# EAGLE design Trabajo3 (EAGLE 9.6.2)
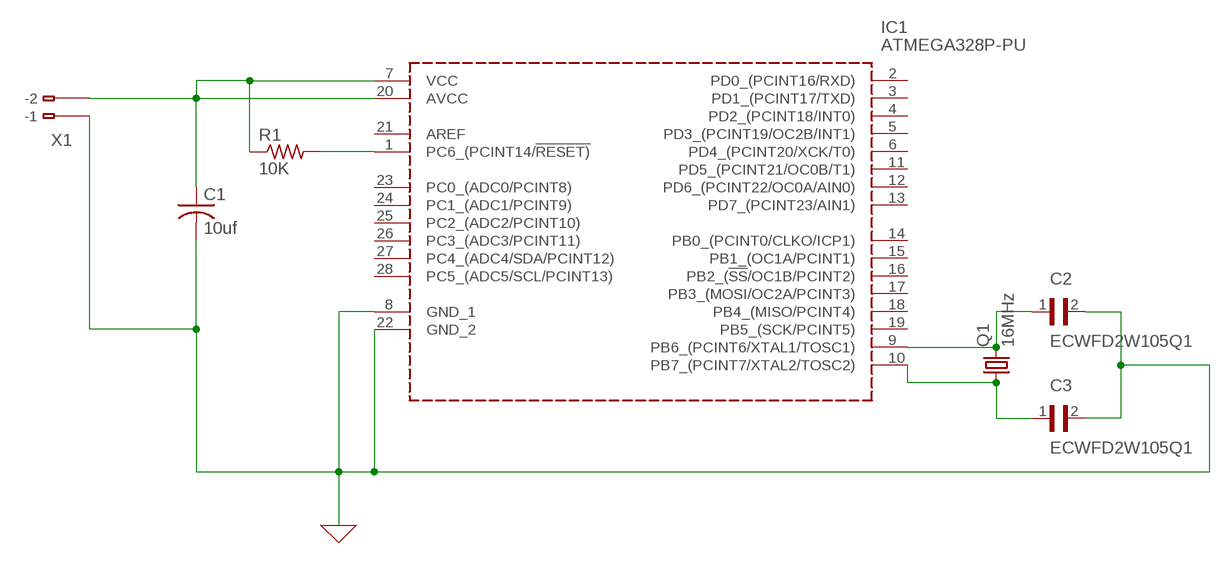
[diagram p0: schematic, sheet 1]

## Parts
C1  10uf  C-US025-024X044  [C025-024X044]
C2  ECWFD2W105Q1  [CAPRR1000W60L1260T920H1390]
C3  ECWFD2W105Q1  [CAPRR1000W60L1260T920H1390]
IC1  ATMEGA328P-PU  [DIP794W53P254L3467H457Q28N]
Q1  16MHz  CRYSTALHC33U-V  [HC33U-V]
R1  10K  R-US_0204/2V  [0204V]
X1  233-102  [233-102]

## Nets
0: C1.2 C2.2 C3.2 IC1.8(GND_1) IC1.22(GND_2) X1.B1(B-1) ; supply symbol labelled GND
N$1: C2.1 IC1.9(PB6_(PCINT6/XTAL1/TOSC1)) Q1.2
N$2: C3.1 IC1.10(PB7_(PCINT7/XTAL2/TOSC2)) Q1.1
N$5: IC1.1(PC6_(PCINT14/!RESET)) R1.2
N$6: C1.1 IC1.7(VCC) IC1.20(AVCC) R1.1 X1.B2(B-2)
Unconnected: IC1.2(PD0_(PCINT16/RXD)) IC1.3(PD1_(PCINT17/TXD)) IC1.4(PD2_(PCINT18/INT0)) IC1.5(PD3_(PCINT19/OC2B/INT1)) IC1.6(PD4_(PCINT20/XCK/T0)) IC1.11(PD5_(PCINT21/OC0B/T1)) IC1.12(PD6_(PCINT22/OC0A/AIN0)) IC1.13(PD7_(PCINT23/AIN1)) IC1.14(PB0_(PCINT0/CLKO/ICP1)) IC1.15(PB1_(OC1A/PCINT1)) IC1.16(PB2_(!SS!/OC1B/PCINT2)) IC1.17(PB3_(MOSI/OC2A/PCINT3)) IC1.18(PB4_(MISO/PCINT4)) IC1.19(PB5_(SCK/PCINT5)) IC1.21(AREF) IC1.23(PC0_(ADC0/PCINT8)) IC1.24(PC1_(ADC1/PCINT9)) IC1.25(PC2_(ADC2/PCINT10)) IC1.26(PC3_(ADC3/PCINT11)) IC1.27(PC4_(ADC4/SDA/PCINT12)) IC1.28(PC5_(ADC5/SCL/PCINT13)) X1.A1(-1) X1.A2(-2)

## Library data of the parts
C1 = rcl:C-US: CAPACITOR, American symbol; SPICEPREFIX: C
C2 = ECWFD2W105Q1:ECWFD2W105Q1: Check availability <https://pricing.snapeda.com/parts/ECWFD2W105Q1/Panasonic/view-part?ref=eda>; AVAILABILITY: In Stock; C2: 22Pf; CHECK_PRICES: https://www.snapeda.com/parts/ECWFD2W105Q1/Panasonic/view-part/?ref=eda; DESCRIPTION: Metallized Polypropylene Film Capacitor; MF: Panasonic; MP: ECWFD2W105Q1; PACKAGE: RADIAL-2 Panasonic; PRICE: None; PURCHASE-URL: https://www.snapeda.com/api/url_track_click_mouser/?unipart_id=5786160&manufacturer=Panasonic&part_name=ECWFD2W105Q1&search_term=capacitor; SNAPEDA_LINK: https://www.snapeda.com/parts/ECWFD2W105Q1/Panasonic/view-part/?ref=snap
C3 = ECWFD2W105Q1:ECWFD2W105Q1: Check availability <https://pricing.snapeda.com/parts/ECWFD2W105Q1/Panasonic/view-part?ref=eda>; AVAILABILITY: In Stock; C3: 22Pf; CHECK_PRICES: https://www.snapeda.com/parts/ECWFD2W105Q1/Panasonic/view-part/?ref=eda; DESCRIPTION: Metallized Polypropylene Film Capacitor; MF: Panasonic; MP: ECWFD2W105Q1; PACKAGE: RADIAL-2 Panasonic; PRICE: None; PURCHASE-URL: https://www.snapeda.com/api/url_track_click_mouser/?unipart_id=5786160&manufacturer=Panasonic&part_name=ECWFD2W105Q1&search_term=capacitor; SNAPEDA_LINK: https://www.snapeda.com/parts/ECWFD2W105Q1/Panasonic/view-part/?ref=snap
IC1 = ATMEGA328P-PU:ATMEGA328P-PU: Check availability <https://pricing.snapeda.com/parts/ATMEGA328PPU/Microchip%20Technology/view-part?ref=eda>; AVAILABILITY: In Stock; CHECK_PRICES: https://www.snapeda.com/parts/ATMEGA328PPU/Microchip+Technology/view-part/?ref=eda; DESCRIPTION: AVR AVR® ATmega Microcontroller IC 8-Bit 20MHz 32KB (16K x 16) FLASH 28-PDIP; MF: Microchip Technology; MP: ATMEGA328PPU; PACKAGE: None; PRICE: None; SNAPEDA_LINK: https://www.snapeda.com/parts/ATMEGA328PPU/Microchip+Technology/view-part/?ref=snap
Q1 = crystal:CRYSTAL: CRYSTAL; HOLA: 16MHZ; OC_FARNELL: unknown; OC_NEWARK: unknown
R1 = rcl:R-US_: RESISTOR, American symbol; SPICEPREFIX: R
X1 = con-wago:233-102: WAGO Cage Clamp; MPN: 233-102; OC_FARNELL: unknown; OC_NEWARK: 28K9044

## Board
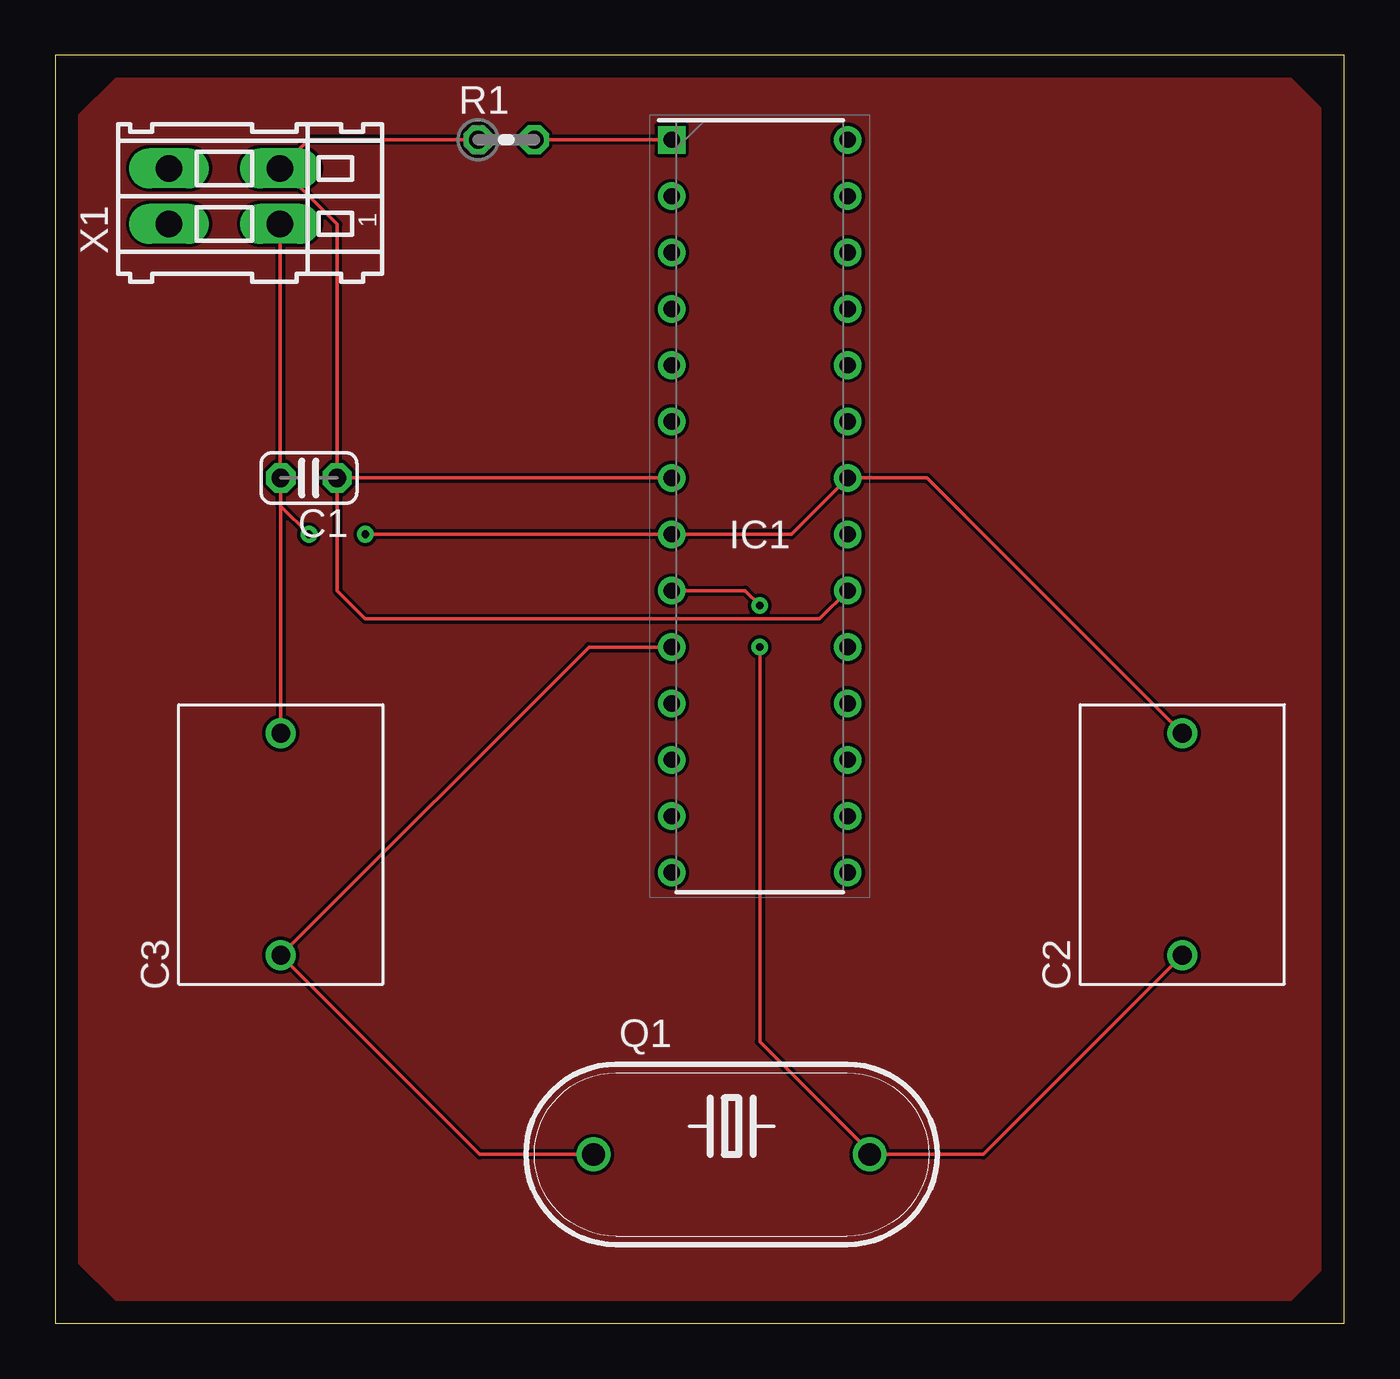
[diagram p1: board, top side]
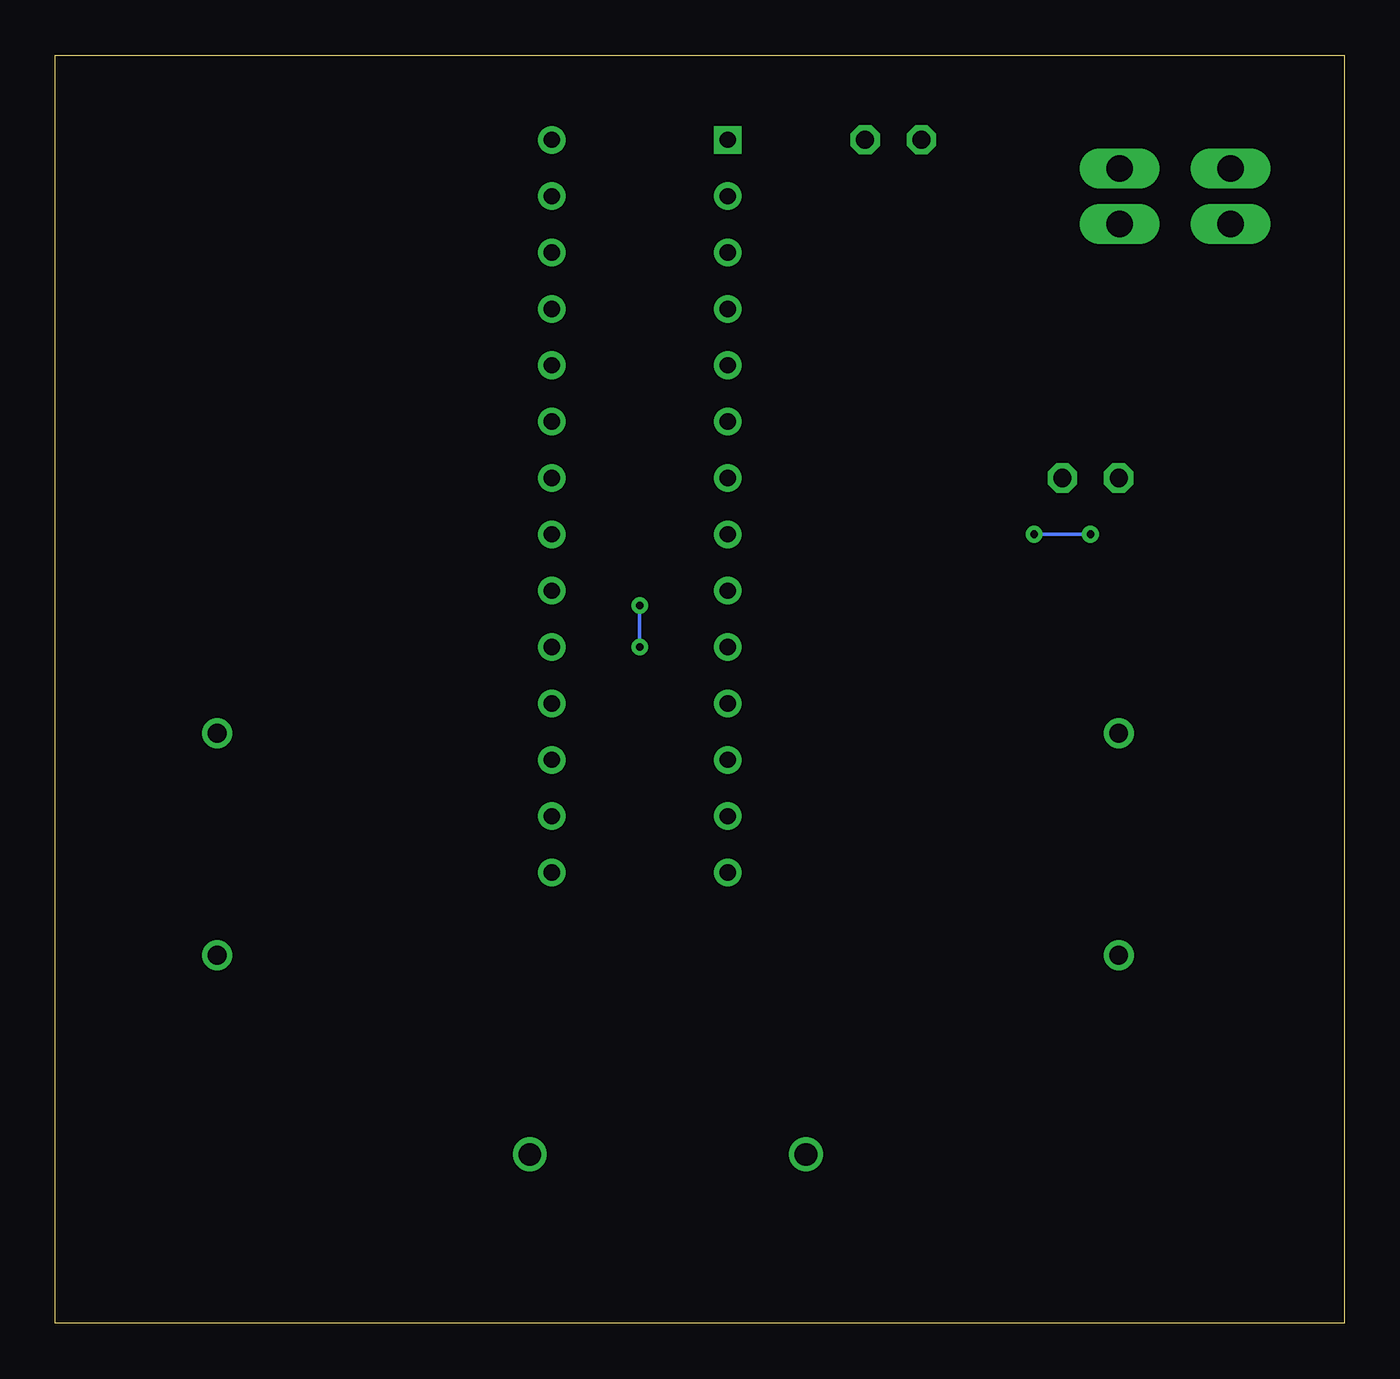
[diagram p2: board, bottom side, seen from below]

Size 58.09 x 57.14 mm. Coordinates in mm from the lower left corner, seen from the top.
Outline: 0,0 58.09,0 58.09,57.14 0,57.14 0,0
Copper layers (1*16): Top 0.035mm / dielectric 1.5mm / Bottom 0.035mm
Design rules "default": minimum track width 6mil, minimum drill 0.35mm, track to track 6mil, track to pad 6mil, pad to pad 6mil, via to via 6mil, smd to smd 6mil, copper to edge 40mil, drill to drill 6mil, minimum pad ring 10mil, minimum via ring 8mil, stop-mask expansion 4mil, vias tented up to drill 0mil, thermal gap 10mil

### Footprints (pad centres in the part's own frame; a part is rotated, then mirrored left to right if it is on the bottom)
C025-024X044 = drill 0.813 octagon: 1 -1.27,0; 2 1.27,0
CAPRR1000W60L1260T920H1390 = drill 0.85 pad 1.2: 1 -5,0; 2 5,0
DIP794W53P254L3467H457Q28N = drill 0.733 pad 1.133 square: 1 -3.969,16.51 | drill 0.733 pad 1.133: 2 -3.969,13.97; 3 -3.969,11.43; 4 -3.969,8.89; 5 -3.969,6.35; 6 -3.969,3.81; 7 -3.969,1.27; 8 -3.969,-1.27; 9 -3.969,-3.81; 10 -3.969,-6.35; 11 -3.969,-8.89; 12 -3.969,-11.43; 13 -3.969,-13.97; 14 -3.969,-16.51; 15 3.969,-16.51; 16 3.969,-13.97; 17 3.969,-11.43; 18 3.969,-8.89; 19 3.969,-6.35; 20 3.969,-3.81; 21 3.969,-1.27; 22 3.969,1.27; 23 3.969,3.81; 24 3.969,6.35; 25 3.969,8.89; 26 3.969,11.43; 27 3.969,13.97; 28 3.969,16.51
HC33U-V = drill 1.016: 1 -6.223,0; 2 6.223,0
0204V = drill 0.813 octagon: 1 -1.27,0; 2 1.27,0
233-102 = drill 1.2 long: A1 -1.25,2.5; A2 1.25,2.5; B1 -1.25,-2.5; B2 1.25,-2.5

### Placement (x,y rotation side)
C1  11.43,38.1 180 top
C2  50.8,21.59 90 top
C3  10.16,21.59 90 top
IC1  31.75,36.83 0 top
Q1  30.48,7.62 0 top
R1  20.32,53.34 0 top
X1  7.62,50.8 90 top

### Tracks (layer width: path | path; a pad name or v marks a point on that pad's centre or on a via)
0  (via drill 0.35)
  Top 0.152: X1.B1 10.12,38.14 C1.2 | C1.2 C3.2 | v13.97,35.56 IC1.8 33.18,35.56 IC1.22 39.29,38.1 C2.2 | v11.43,35.56 10.16,36.83 C1.2
  Bottom 0.152: v13.97,35.56 v11.43,35.56
GND
  pour Top: 0,53.34 3.81,57.15 54.61,57.15 58.42,53.34 58.42,3.81 54.61,0 3.81,0 0,3.81
N$1  (via drill 0.35)
  Top 0.152: C2.1 41.83,7.62 36.83,7.62 | 36.83,7.62 Q1.2 | IC1.9 31.09,33.02 v31.75,32.36 | v31.75,30.48 31.75,12.7 36.83,7.62
  Bottom 0.152: v31.75,32.36 v31.75,30.48
N$2
  Top 0.152: Q1.1 19.13,7.62 C3.1 24.05,30.48 IC1.10
N$5
  Top 0.152: IC1.1 R1.2
N$6
  Top 0.152: R1.1 11.41,53.34 10.15,52.08 | 10.15,52.08 X1.B2 | C1.1 IC1.7 | 10.15,52.08 12.7,49.53 C1.1 | C1.1 12.7,33.02 13.97,31.75 34.45,31.75 IC1.20